# Altium schematic sheet VoltageAmplifier_1xFPGA.SchDoc
size 635 x 241 mm
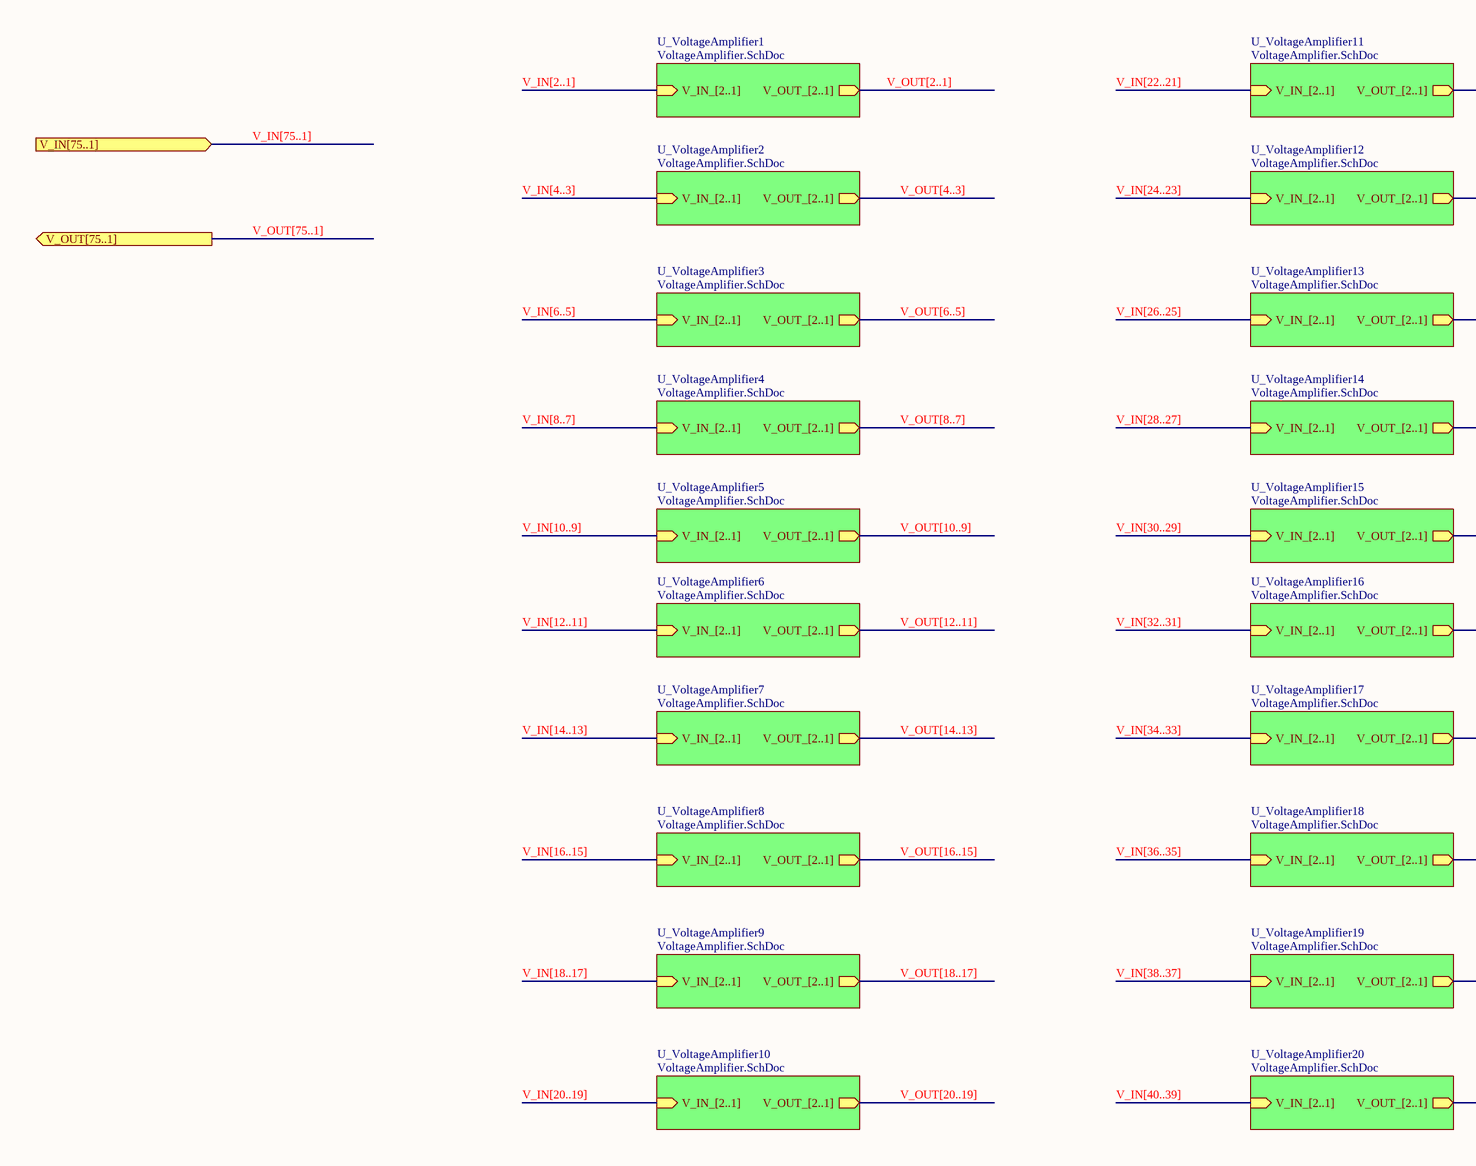
[diagram p0: VoltageAmplifier_1xFPGA.SchDoc, left]
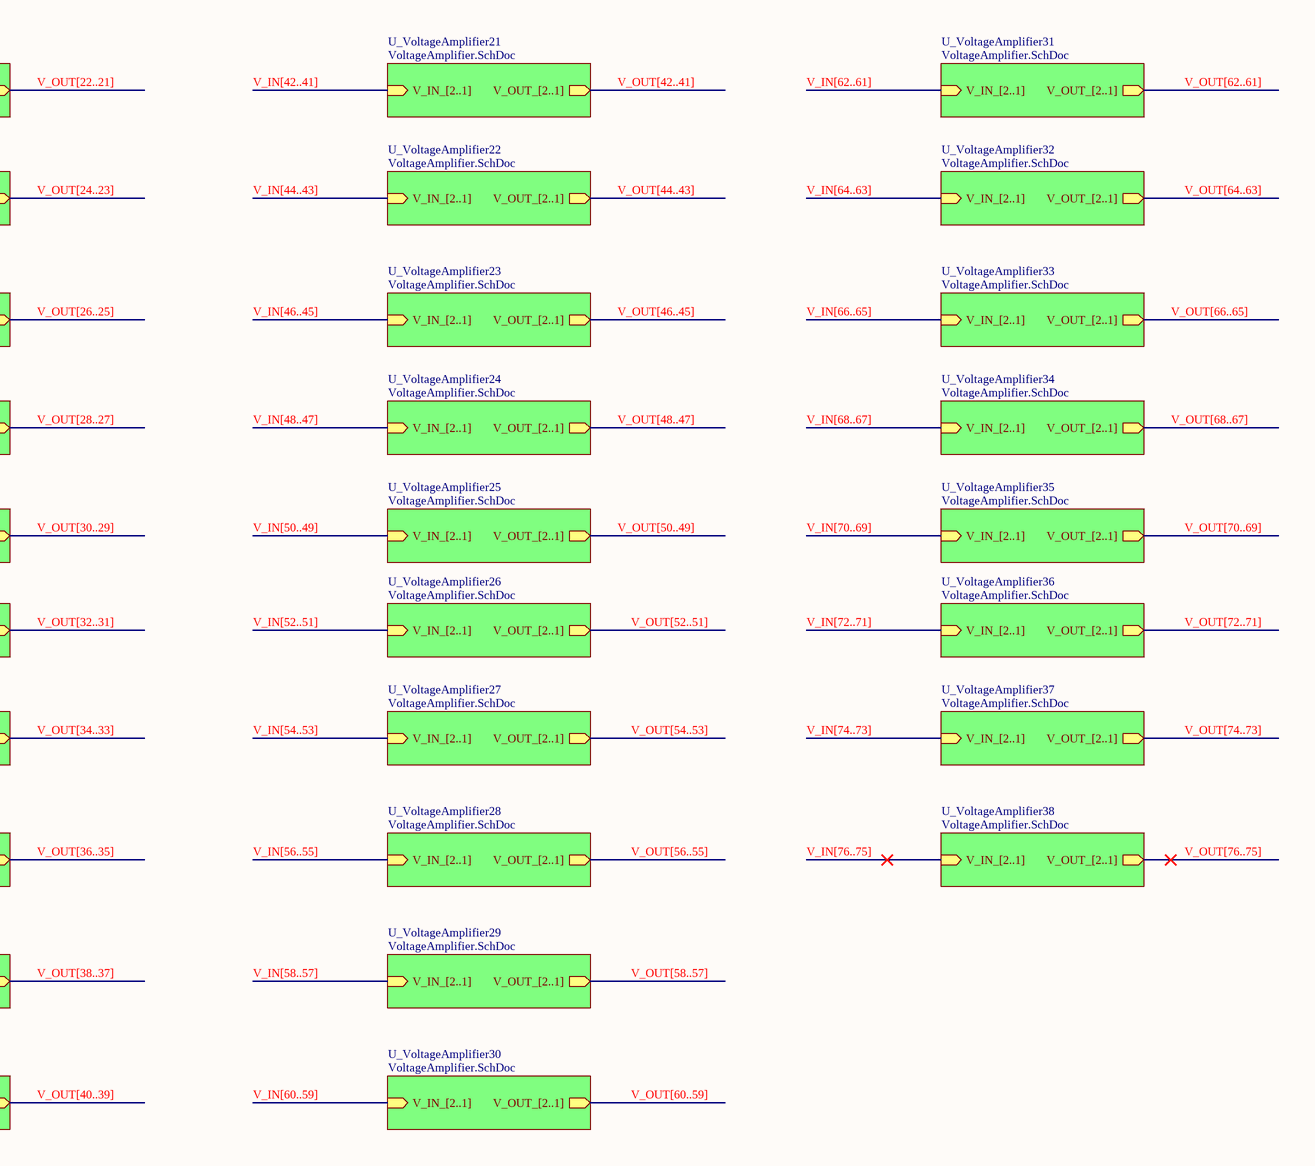
[diagram p1: VoltageAmplifier_1xFPGA.SchDoc, right]

## Sub-sheets
U_VoltageAmplifier1 = VoltageAmplifier.SchDoc: V_OUT_[2..1] (out), V_IN_[2..1] (in)
U_VoltageAmplifier2 = VoltageAmplifier.SchDoc: V_OUT_[2..1] (out), V_IN_[2..1] (in)
U_VoltageAmplifier3 = VoltageAmplifier.SchDoc: V_OUT_[2..1] (out), V_IN_[2..1] (in)
U_VoltageAmplifier4 = VoltageAmplifier.SchDoc: V_OUT_[2..1] (out), V_IN_[2..1] (in)
U_VoltageAmplifier5 = VoltageAmplifier.SchDoc: V_OUT_[2..1] (out), V_IN_[2..1] (in)
U_VoltageAmplifier6 = VoltageAmplifier.SchDoc: V_OUT_[2..1] (out), V_IN_[2..1] (in)
U_VoltageAmplifier7 = VoltageAmplifier.SchDoc: V_OUT_[2..1] (out), V_IN_[2..1] (in)
U_VoltageAmplifier8 = VoltageAmplifier.SchDoc: V_OUT_[2..1] (out), V_IN_[2..1] (in)
U_VoltageAmplifier9 = VoltageAmplifier.SchDoc: V_OUT_[2..1] (out), V_IN_[2..1] (in)
U_VoltageAmplifier10 = VoltageAmplifier.SchDoc: V_OUT_[2..1] (out), V_IN_[2..1] (in)
U_VoltageAmplifier11 = VoltageAmplifier.SchDoc: V_OUT_[2..1] (out), V_IN_[2..1] (in)
U_VoltageAmplifier12 = VoltageAmplifier.SchDoc: V_OUT_[2..1] (out), V_IN_[2..1] (in)
U_VoltageAmplifier13 = VoltageAmplifier.SchDoc: V_OUT_[2..1] (out), V_IN_[2..1] (in)
U_VoltageAmplifier14 = VoltageAmplifier.SchDoc: V_OUT_[2..1] (out), V_IN_[2..1] (in)
U_VoltageAmplifier15 = VoltageAmplifier.SchDoc: V_OUT_[2..1] (out), V_IN_[2..1] (in)
U_VoltageAmplifier16 = VoltageAmplifier.SchDoc: V_OUT_[2..1] (out), V_IN_[2..1] (in)
U_VoltageAmplifier17 = VoltageAmplifier.SchDoc: V_OUT_[2..1] (out), V_IN_[2..1] (in)
U_VoltageAmplifier18 = VoltageAmplifier.SchDoc: V_OUT_[2..1] (out), V_IN_[2..1] (in)
U_VoltageAmplifier19 = VoltageAmplifier.SchDoc: V_OUT_[2..1] (out), V_IN_[2..1] (in)
U_VoltageAmplifier20 = VoltageAmplifier.SchDoc: V_OUT_[2..1] (out), V_IN_[2..1] (in)
U_VoltageAmplifier21 = VoltageAmplifier.SchDoc: V_OUT_[2..1] (out), V_IN_[2..1] (in)
U_VoltageAmplifier22 = VoltageAmplifier.SchDoc: V_OUT_[2..1] (out), V_IN_[2..1] (in)
U_VoltageAmplifier23 = VoltageAmplifier.SchDoc: V_OUT_[2..1] (out), V_IN_[2..1] (in)
U_VoltageAmplifier24 = VoltageAmplifier.SchDoc: V_OUT_[2..1] (out), V_IN_[2..1] (in)
U_VoltageAmplifier25 = VoltageAmplifier.SchDoc: V_OUT_[2..1] (out), V_IN_[2..1] (in)
U_VoltageAmplifier26 = VoltageAmplifier.SchDoc: V_OUT_[2..1] (out), V_IN_[2..1] (in)
U_VoltageAmplifier27 = VoltageAmplifier.SchDoc: V_OUT_[2..1] (out), V_IN_[2..1] (in)
U_VoltageAmplifier28 = VoltageAmplifier.SchDoc: V_OUT_[2..1] (out), V_IN_[2..1] (in)
U_VoltageAmplifier29 = VoltageAmplifier.SchDoc: V_OUT_[2..1] (out), V_IN_[2..1] (in)
U_VoltageAmplifier30 = VoltageAmplifier.SchDoc: V_OUT_[2..1] (out), V_IN_[2..1] (in)
U_VoltageAmplifier31 = VoltageAmplifier.SchDoc: V_OUT_[2..1] (out), V_IN_[2..1] (in)
U_VoltageAmplifier32 = VoltageAmplifier.SchDoc: V_OUT_[2..1] (out), V_IN_[2..1] (in)
U_VoltageAmplifier33 = VoltageAmplifier.SchDoc: V_OUT_[2..1] (out), V_IN_[2..1] (in)
U_VoltageAmplifier34 = VoltageAmplifier.SchDoc: V_OUT_[2..1] (out), V_IN_[2..1] (in)
U_VoltageAmplifier35 = VoltageAmplifier.SchDoc: V_OUT_[2..1] (out), V_IN_[2..1] (in)
U_VoltageAmplifier36 = VoltageAmplifier.SchDoc: V_OUT_[2..1] (out), V_IN_[2..1] (in)
U_VoltageAmplifier37 = VoltageAmplifier.SchDoc: V_OUT_[2..1] (out), V_IN_[2..1] (in)
U_VoltageAmplifier38 = VoltageAmplifier.SchDoc: V_OUT_[2..1] (out), V_IN_[2..1] (in)

## Ports
V_IN[75..1] (in), V_OUT[75..1] (out)

## Buses and harness runs
bus V_IN[2..1] = sheet U_VoltageAmplifier1/V_IN_[2..1]
bus V_IN[4..3] = sheet U_VoltageAmplifier2/V_IN_[2..1]
bus V_IN[6..5] = sheet U_VoltageAmplifier3/V_IN_[2..1]
bus V_IN[8..7] = sheet U_VoltageAmplifier4/V_IN_[2..1]
bus V_IN[10..9] = sheet U_VoltageAmplifier5/V_IN_[2..1]
bus V_IN[12..11] = sheet U_VoltageAmplifier6/V_IN_[2..1]
bus V_IN[14..13] = sheet U_VoltageAmplifier7/V_IN_[2..1]
bus V_IN[16..15] = sheet U_VoltageAmplifier8/V_IN_[2..1]
bus V_IN[18..17] = sheet U_VoltageAmplifier9/V_IN_[2..1]
bus V_IN[20..19] = sheet U_VoltageAmplifier10/V_IN_[2..1]
bus V_IN[22..21] = sheet U_VoltageAmplifier11/V_IN_[2..1]
bus V_IN[24..23] = sheet U_VoltageAmplifier12/V_IN_[2..1]
bus V_IN[26..25] = sheet U_VoltageAmplifier13/V_IN_[2..1]
bus V_IN[28..27] = sheet U_VoltageAmplifier14/V_IN_[2..1]
bus V_IN[30..29] = sheet U_VoltageAmplifier15/V_IN_[2..1]
bus V_IN[32..31] = sheet U_VoltageAmplifier16/V_IN_[2..1]
bus V_IN[34..33] = sheet U_VoltageAmplifier17/V_IN_[2..1]
bus V_IN[36..35] = sheet U_VoltageAmplifier18/V_IN_[2..1]
bus V_IN[38..37] = sheet U_VoltageAmplifier19/V_IN_[2..1]
bus V_IN[40..39] = sheet U_VoltageAmplifier20/V_IN_[2..1]
bus V_IN[42..41] = sheet U_VoltageAmplifier21/V_IN_[2..1]
bus V_IN[44..43] = sheet U_VoltageAmplifier22/V_IN_[2..1]
bus V_IN[46..45] = sheet U_VoltageAmplifier23/V_IN_[2..1]
bus V_IN[48..47] = sheet U_VoltageAmplifier24/V_IN_[2..1]
bus V_IN[50..49] = sheet U_VoltageAmplifier25/V_IN_[2..1]
bus V_IN[52..51] = sheet U_VoltageAmplifier26/V_IN_[2..1]
bus V_IN[54..53] = sheet U_VoltageAmplifier27/V_IN_[2..1]
bus V_IN[56..55] = sheet U_VoltageAmplifier28/V_IN_[2..1]
bus V_IN[58..57] = sheet U_VoltageAmplifier29/V_IN_[2..1]
bus V_IN[60..59] = sheet U_VoltageAmplifier30/V_IN_[2..1]
bus V_IN[62..61] = sheet U_VoltageAmplifier31/V_IN_[2..1]
bus V_IN[64..63] = sheet U_VoltageAmplifier32/V_IN_[2..1]
bus V_IN[66..65] = sheet U_VoltageAmplifier33/V_IN_[2..1]
bus V_IN[68..67] = sheet U_VoltageAmplifier34/V_IN_[2..1]
bus V_IN[70..69] = sheet U_VoltageAmplifier35/V_IN_[2..1]
bus V_IN[72..71] = sheet U_VoltageAmplifier36/V_IN_[2..1]
bus V_IN[74..73] = sheet U_VoltageAmplifier37/V_IN_[2..1]
bus V_IN[75..1] = port V_IN[75..1]
bus V_IN[76..75] = sheet U_VoltageAmplifier38/V_IN_[2..1]
bus V_OUT[2..1] = sheet U_VoltageAmplifier1/V_OUT_[2..1]
bus V_OUT[4..3] = sheet U_VoltageAmplifier2/V_OUT_[2..1]
bus V_OUT[6..5] = sheet U_VoltageAmplifier3/V_OUT_[2..1]
bus V_OUT[8..7] = sheet U_VoltageAmplifier4/V_OUT_[2..1]
bus V_OUT[10..9] = sheet U_VoltageAmplifier5/V_OUT_[2..1]
bus V_OUT[12..11] = sheet U_VoltageAmplifier6/V_OUT_[2..1]
bus V_OUT[14..13] = sheet U_VoltageAmplifier7/V_OUT_[2..1]
bus V_OUT[16..15] = sheet U_VoltageAmplifier8/V_OUT_[2..1]
bus V_OUT[18..17] = sheet U_VoltageAmplifier9/V_OUT_[2..1]
bus V_OUT[20..19] = sheet U_VoltageAmplifier10/V_OUT_[2..1]
bus V_OUT[22..21] = sheet U_VoltageAmplifier11/V_OUT_[2..1]
bus V_OUT[24..23] = sheet U_VoltageAmplifier12/V_OUT_[2..1]
bus V_OUT[26..25] = sheet U_VoltageAmplifier13/V_OUT_[2..1]
bus V_OUT[28..27] = sheet U_VoltageAmplifier14/V_OUT_[2..1]
bus V_OUT[30..29] = sheet U_VoltageAmplifier15/V_OUT_[2..1]
bus V_OUT[32..31] = sheet U_VoltageAmplifier16/V_OUT_[2..1]
bus V_OUT[34..33] = sheet U_VoltageAmplifier17/V_OUT_[2..1]
bus V_OUT[36..35] = sheet U_VoltageAmplifier18/V_OUT_[2..1]
bus V_OUT[38..37] = sheet U_VoltageAmplifier19/V_OUT_[2..1]
bus V_OUT[40..39] = sheet U_VoltageAmplifier20/V_OUT_[2..1]
bus V_OUT[42..41] = sheet U_VoltageAmplifier21/V_OUT_[2..1]
bus V_OUT[44..43] = sheet U_VoltageAmplifier22/V_OUT_[2..1]
bus V_OUT[46..45] = sheet U_VoltageAmplifier23/V_OUT_[2..1]
bus V_OUT[48..47] = sheet U_VoltageAmplifier24/V_OUT_[2..1]
bus V_OUT[50..49] = sheet U_VoltageAmplifier25/V_OUT_[2..1]
bus V_OUT[52..51] = sheet U_VoltageAmplifier26/V_OUT_[2..1]
bus V_OUT[54..53] = sheet U_VoltageAmplifier27/V_OUT_[2..1]
bus V_OUT[56..55] = sheet U_VoltageAmplifier28/V_OUT_[2..1]
bus V_OUT[58..57] = sheet U_VoltageAmplifier29/V_OUT_[2..1]
bus V_OUT[60..59] = sheet U_VoltageAmplifier30/V_OUT_[2..1]
bus V_OUT[62..61] = sheet U_VoltageAmplifier31/V_OUT_[2..1]
bus V_OUT[64..63] = sheet U_VoltageAmplifier32/V_OUT_[2..1]
bus V_OUT[66..65] = sheet U_VoltageAmplifier33/V_OUT_[2..1]
bus V_OUT[68..67] = sheet U_VoltageAmplifier34/V_OUT_[2..1]
bus V_OUT[70..69] = sheet U_VoltageAmplifier35/V_OUT_[2..1]
bus V_OUT[72..71] = sheet U_VoltageAmplifier36/V_OUT_[2..1]
bus V_OUT[74..73] = sheet U_VoltageAmplifier37/V_OUT_[2..1]
bus V_OUT[75..1] = port V_OUT[75..1]
bus V_OUT[76..75] = sheet U_VoltageAmplifier38/V_OUT_[2..1]